# EAGLE design board (EAGLE 9.1.2)
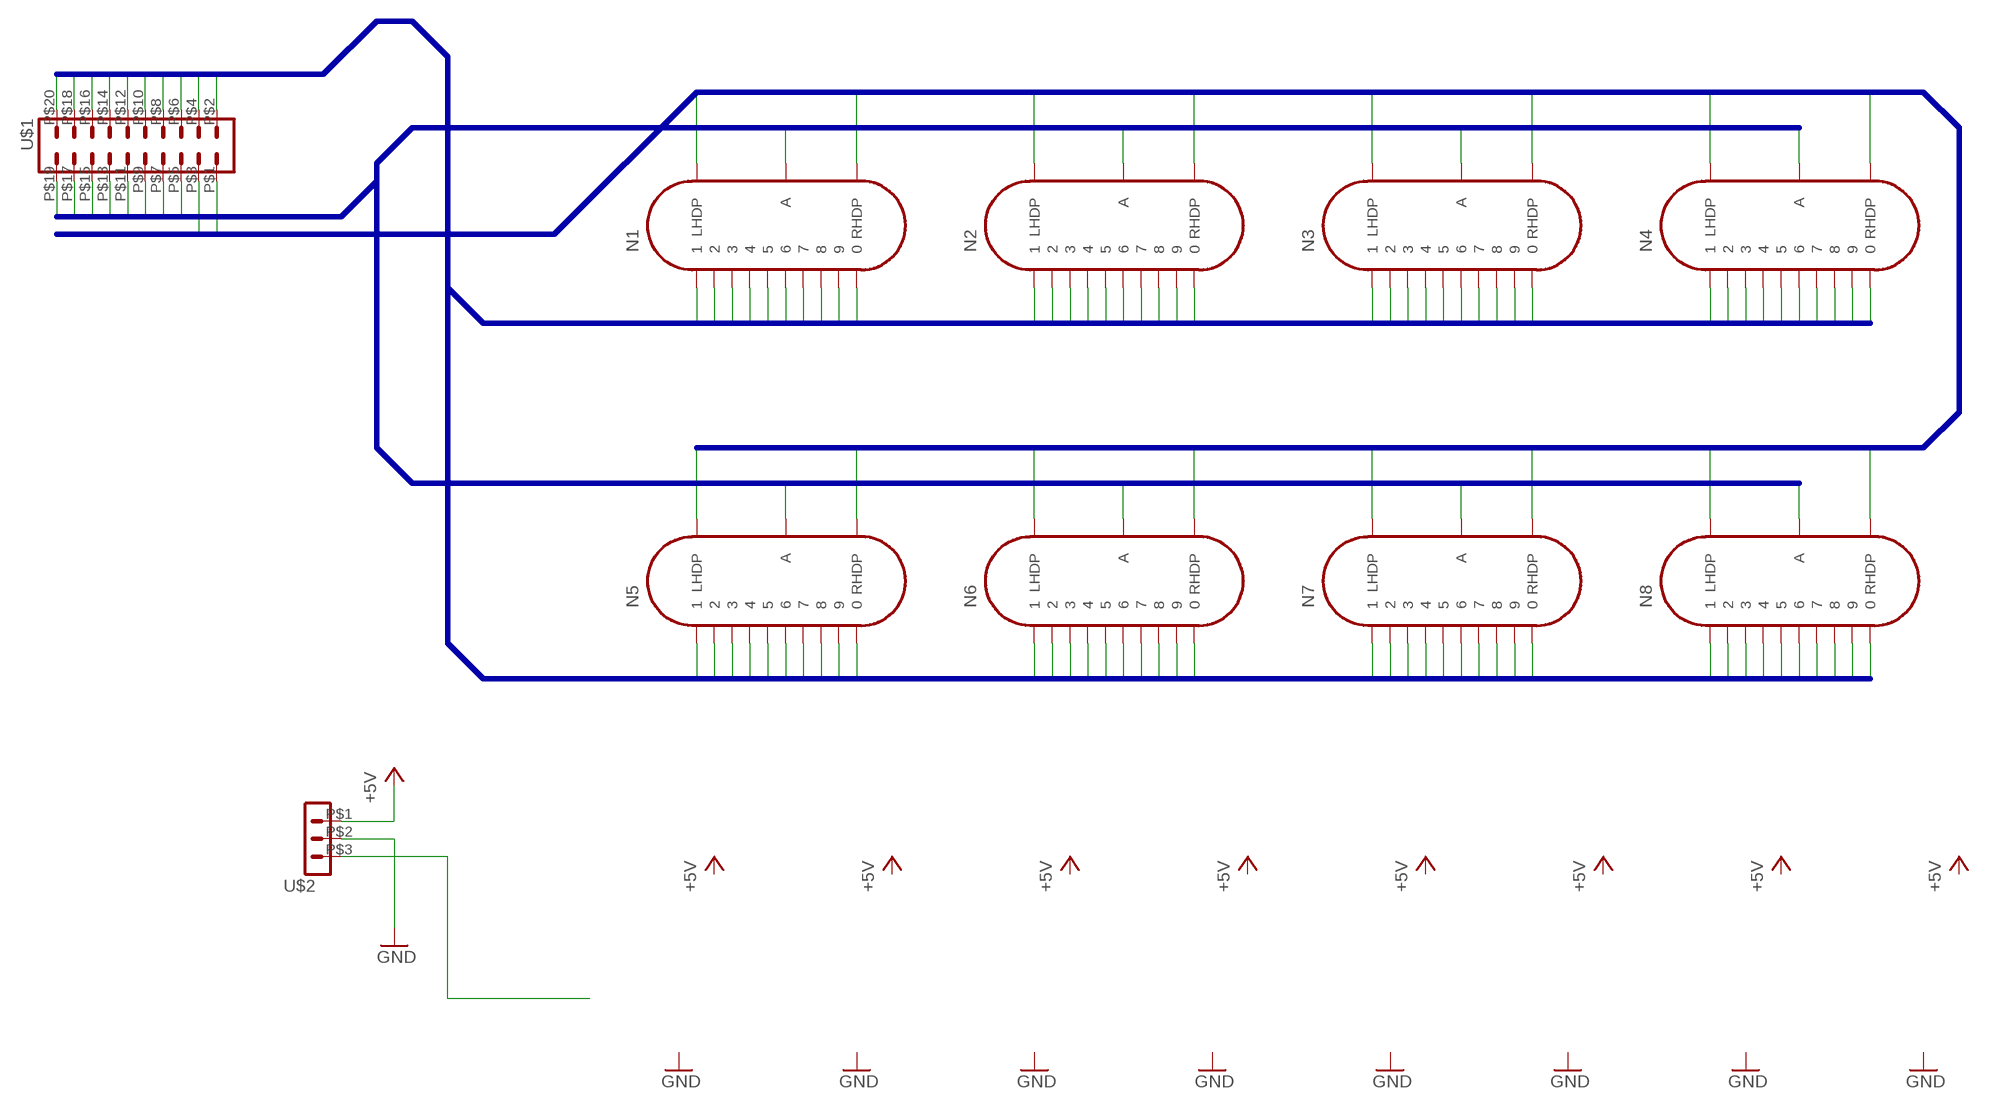
[diagram p0: schematic, sheet 1]

## Parts
N1  IN-14  [IN-14]
N2  IN-14  [IN-14]
N3  IN-14  [IN-14]
N4  IN-14  [IN-14]
N5  IN-14  [IN-14]
N6  IN-14  [IN-14]
N7  IN-14  [IN-14]
N8  IN-14  [IN-14]
U$1  PIN_HEADER_MALE_2X10_20P  [PIN_HEADER_MALE_2X10_20P]
U$2  PIN_HEADER_MALE_1X03_03P  [PIN_HEADER_MALE_1X03_03P]

## Nets
+5V: U$2.P$1
DOT0: N1.LHDP N2.LHDP N3.LHDP N4.LHDP N5.LHDP N6.LHDP N7.LHDP N8.LHDP U$1.P$3
DOT1: N1.RHDP N2.RHDP N3.RHDP N4.RHDP N5.RHDP N6.RHDP N7.RHDP N8.RHDP U$1.P$1
GND: U$2.P$2
N$8: U$2.P$3
NIXIE0: N1.0 N2.0 N3.0 N4.0 N5.0 N6.0 N7.0 N8.0 U$1.P$20
NIXIE1: N1.1 N2.1 N3.1 N4.1 N5.1 N6.1 N7.1 N8.1 U$1.P$18
NIXIE2: N1.2 N2.2 N3.2 N4.2 N5.2 N6.2 N7.2 N8.2 U$1.P$16
NIXIE3: N1.3 N2.3 N3.3 N4.3 N5.3 N6.3 N7.3 N8.3 U$1.P$14
NIXIE4: N1.4 N2.4 N3.4 N4.4 N5.4 N6.4 N7.4 N8.4 U$1.P$12
NIXIE5: N1.5 N2.5 N3.5 N4.5 N5.5 N6.5 N7.5 N8.5 U$1.P$10
NIXIE6: N1.6 N2.6 N3.6 N4.6 N5.6 N6.6 N7.6 N8.6 U$1.P$8
NIXIE7: N1.7 N2.7 N3.7 N4.7 N5.7 N6.7 N7.7 N8.7 U$1.P$6
NIXIE8: N1.8 N2.8 N3.8 N4.8 N5.8 N6.8 N7.8 N8.8 U$1.P$4
NIXIE9: N1.9 N2.9 N3.9 N4.9 N5.9 N6.9 N7.9 N8.9 U$1.P$2
NIXIE_ANODE1: N1.A U$1.P$5
NIXIE_ANODE2: N2.A U$1.P$7
NIXIE_ANODE3: N3.A U$1.P$9
NIXIE_ANODE4: N4.A U$1.P$11
NIXIE_ANODE5: N5.A U$1.P$13
NIXIE_ANODE6: N6.A U$1.P$15
NIXIE_ANODE7: N7.A U$1.P$17
NIXIE_ANODE8: N8.A U$1.P$19

## Buses
NIXIE_ANODE[1..16]
NIXIE[0..9]
DOT[0..1]

## Library data of the parts
N1-N8 = russian-nixies:IN-14: IN-14: medium numeric frontview nixie tube
U$1 = 160713 Library by matsu:PIN_HEADER_MALE_2X10_20P
U$2 = 160713 Library by matsu:PIN_HEADER_MALE_1X03_03P

## Net classes
0 default: width 0.635 mm, clearance 0.381 mm

## Board
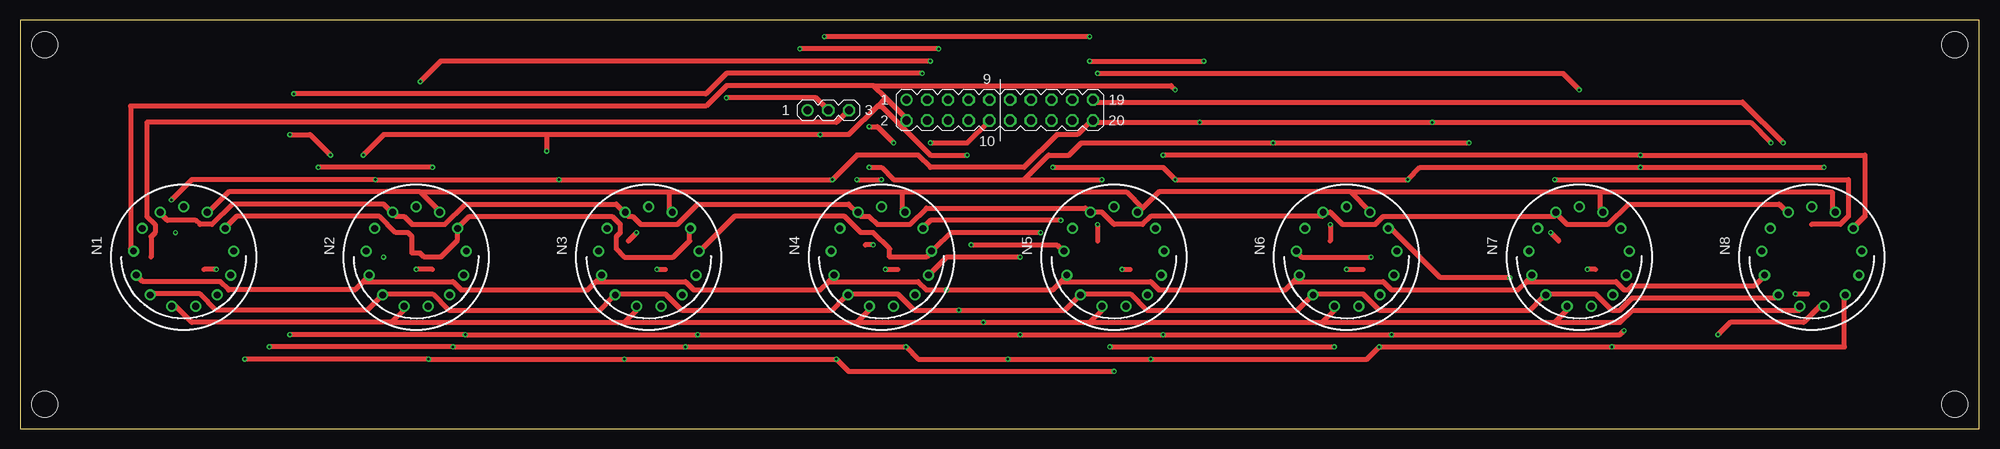
[diagram p1: board, top side]
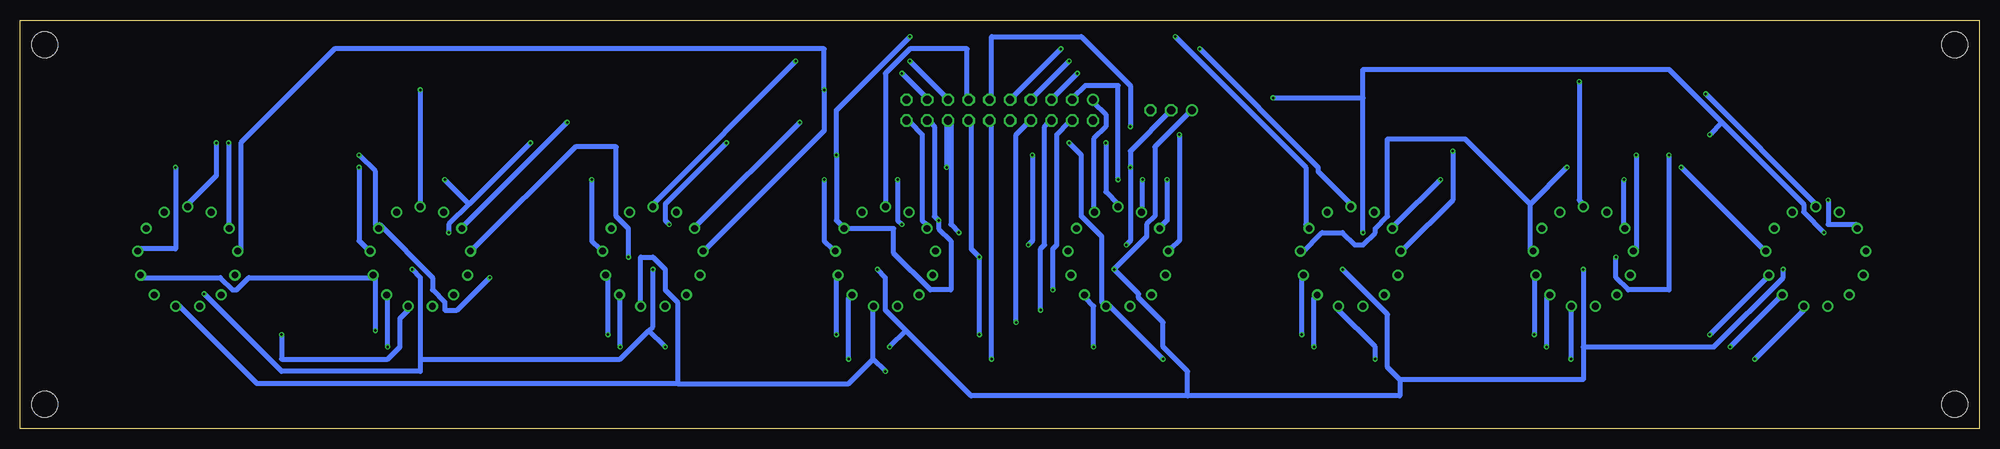
[diagram p2: board, bottom side, seen from below]

Size 240 x 50 mm. Coordinates in mm from the lower left corner, seen from the top.
Outline: 0,0 240,0 240,50 0,50 0,0
Copper layers (1*16): Top 0.035mm / dielectric 1.5mm / Bottom 0.035mm
Design rules "Elecrow_2-layer_eagle_rule": minimum track width 6mil, minimum drill 12mil, track to track 6mil, track to pad 6mil, pad to pad 6mil, via to via 6mil, smd to smd 0mil, copper to edge 10mil, drill to drill 10mil, minimum pad ring 10mil, minimum via ring 6mil, stop-mask expansion 2mil, vias tented up to drill 100mil, thermal gap 10mil
Holes 3.2 mm at 3,47 3,3 237,47 237,3

### Footprints (pad centres in the part's own frame; a part is rotated, then mirrored left to right if it is on the bottom)
IN-14 = drill 0.84: 0 5.094,-3.516; 1 -5.094,-3.516; 2 -6.145,-0.746; 3 -5.788,2.195; 4 -4.105,4.633; 5 -1.481,6.01; 6 1.481,6.01; 7 4.105,4.633; 8 5.788,2.195; 9 6.145,-0.746; A 0,-6.19; LHDP 2.877,-5.481; RHDP -2.877,-5.481
PIN_HEADER_MALE_2X10_20P = drill 1: P$1 -11.43,1.27 | drill 1 octagon: P$2 -11.43,-1.27; P$3 -8.89,1.27; P$4 -8.89,-1.27; P$5 -6.35,1.27; P$6 -6.35,-1.27; P$7 -3.81,1.27; P$8 -3.81,-1.27; P$9 -1.27,1.27; P$10 -1.27,-1.27; P$11 1.27,1.27; P$12 1.27,-1.27; P$13 3.81,1.27; P$14 3.81,-1.27; P$15 6.35,1.27; P$16 6.35,-1.27; P$17 8.89,1.27; P$18 8.89,-1.27; P$19 11.43,1.27; P$20 11.43,-1.27
PIN_HEADER_MALE_1X03_03P = drill 1: P$1 -2.54,0 | drill 1 octagon: P$2 0,0; P$3 2.54,0

### Placement (x,y rotation side)
N1  20,21 180 top
N2  48.5,21 180 top
N3  77,21 180 top
N4  105.5,21 180 top
N5  134,21 180 top
N6  162.5,21 180 top
N7  191,21 180 top
N8  219.5,21 180 top
U$1  120,39 0 top
U$2  99,39 0 top

### Tracks (layer width: path | path; a pad name or v marks a point on that pad's centre or on a via)
+5V  (via drill 0.3)
  Top 0.635: v162.5,19.5 164.5,19.5 | 193,19.5 v192,19.5 | v217.5,16.5 219,16.5 | v106,19.5 107.5,19.5 | v24,19.5 22.5,19.5 | 50.5,19.5 v48.5,19.5 | v78,19.5 79,19.5 | v135,19.5 136,19.5 | v133.5,10 v161,10
  Bottom 0.635: v162.5,19.5 162.5,12.5 163,12 | 163,12 166.5,8.5 191,8.5 | 191,8.5 191,18.5 v192,19.5 | v217.5,16.5 208,7 191,7 191,8.5 | U$2.P$1 96.5,39 101,34.5 101,26 102,25 102,23.5 v106,19.5 103,16.5 103,16 100,13 100,10 97,7 97,4 | v24,19.5 24,18.5 32.5,10 48.5,10 | v48.5,19.5 48.5,10 | v78,19.5 72.5,14 72.5,7.5 71,6 | 71,6 48.5,6 48.5,10 | v135,19.5 134,18.5 134,14.5 131.5,12 | 131.5,12 123.5,4 97,4 | 97,4 71,4 71,6 | v161,10 163,12 | 131.5,12 v133.5,10
DOT0  (via drill 0.3)
  Top 0.635: N8.LHDP 216.5,26.5 215.5,27.5 197,27.5 194.5,25 189.5,25 188.5,26 N7.LHDP 188,26 167,26 166,25 162,25 160.5,26.5 160,26.5 N6.LHDP 159.5,26 138.5,26 137.5,25 134,25 132.5,26.5 131.5,26.5 N5.LHDP 131,26.5 130.5,27 111,27 109,25 105,25 104,26 103,26 N4.LHDP 102.5,26.5 101.5,27.5 83,27.5 80.5,25 76,25 75,26 74.5,26 N3.LHDP 74,26.5 73,27.5 54.5,27.5 52,25 48,25 47,26 46,26 N2.LHDP 45.5,26.5 44.5,27.5 26,27.5 23.5,25 22,25 21.5,25.5 18,25.5 17.5,26 N1.LHDP | v102.5,30.5 v105.5,30.5
  Bottom 0.635: v105.5,30.5 105.5,42 109.5,42 111,40.5 U$1.P$3 | v102.5,30.5 102.5,26.5 N4.LHDP
DOT1
  Top 0.635: 137.5,27 139.5,29 163,29 | 137.5,27 137,26.5 N5.RHDP | 163,29 165.5,26.5 N6.RHDP | 193.5,29 193.5,26.5 N7.RHDP | 163,29 193.5,29 | 193.5,29 222,29 222,26.5 N8.RHDP | 49,29 25.5,29 23,26.5 N1.RHDP | 49,29 51.5,26.5 N2.RHDP | 79.5,29 79.5,26.5 N3.RHDP | 49,29 79.5,29 | 108,29 108,26.5 N4.RHDP | 79.5,29 108,29 | 137.5,27 135.5,29 108,29
  Bottom 0.635: N4.RHDP 108.5,26.5 108.5,35.5 107,37 107,38.5 108.5,40 U$1.P$1
GND  (via drill 0.3)
  Top 0.635: 74.5,23 v75.5,24 | v38,33.5 35.5,36 v33,36 | v104.5,22.5 103.5,22.5 | v132,25 132,23 | 123,30.5 107,30.5 105.5,32 v104,32 | 123,30.5 v132.5,30.5 | v160.5,25 160.5,23 | 123,30.5 126,33.5 128.5,33.5 130,35 v153.5,35 v177.5,35 | v187.5,24 188.5,23 | 219.5,25 223,25 224,26 224,30.5 v188,30.5 | v86.5,40.5 97.5,40.5 U$2.P$2
  Bottom 0.635: v19,24 21.5,26.5 21.5,27.5 31.5,37.5 | 31.5,37.5 38,44 75.5,44 75.5,40.5 | v75.5,24 75.5,40.5 | v44.5,21 44.5,18.5 43,17 38,17 v38,33.5 | 31.5,37.5 v33,36 | v104.5,22.5 104,23 v104,32 104,34 U$2.P$2 | v132,25 132.5,25.5 v132.5,30.5 | v160.5,25 161,25.5 161,27.5 v153.5,35 | v187.5,24 187.5,25 185,27.5 | v177.5,35 185,27.5 | 185,27.5 v188,30.5 | v86.5,40.5 75.5,40.5
N$8
  Top 0.635: 16,21 16,23.5 16.5,24 16.5,25 15.5,26 15.5,37.5 100,37.5 101.5,39 U$2.P$3
NIXIE0  (via drill 0.3)
  Top 0.635: v18.5,28 21,30.5 v43.5,30.5 v66,30.5 v99.5,30.5 102.5,33.5 110,33.5 111.5,32 123,32 127,36 129.5,36 131,37.5 U$1.P$20 131.5,37.5 v144.5,37.5 v173,37.5 212,37.5 v214.5,35
  Bottom 0.635: v18.5,28 18.5,25 15,25 N1.0 | v43.5,30.5 43.5,25 N2.0 | v66,30.5 71.5,25 N3.0 | v99.5,30.5 99.5,25.5 100,25 N4.0 | N5.0 129,25 129.5,25.5 129.5,36 131,37.5 U$1.P$20 | v144.5,37.5 157,25 N6.0 | v173,37.5 185.5,25 N7.0 | v214.5,35 214.5,25 N8.0
NIXIE1  (via drill 0.3)
  Top 0.635: N1.1 25.5,25 26.5,26 44,26 46,24 47.5,24 48,23.5 48,21.5 49,21.5 49.5,21 51.5,21 53.5,23 53.5,24.5 N2.1 54,25 55,26 72.5,26 73.5,25 73.5,24 73,23.5 73,22 74,21 80,21 82,23 82,24.5 N3.1 | v127.5,25.5 111.5,25.5 111,25 N4.1 | v182.5,18.5 174,18.5 168,24.5 N6.1 | N8.1 225,25 226,26 226,33.5 v198.5,33.5 v140,33.5 | v131,48 v98.5,48
  Bottom 0.635: U$1.P$18 128.5,37.5 128,37 128,26 v127.5,25.5 127.5,24.5 126,23 126,17 128.5,17 133,21.5 133,24.5 139,24.5 N5.1 139.5,25 140,25.5 v140,33.5 140,39 v131,48 | v182.5,18.5 186.5,14.5 188,14.5 188,15.5 189.5,17 189.5,18.5 196,25 N7.1 196.5,25 196.5,31.5 v198.5,33.5 | v98.5,48 82.5,32 82.5,25 N3.1
NIXIE2  (via drill 0.3)
  Top 0.635: v50.5,32 v36.5,32 | N3.2 83.5,22 87.5,26 101,26 103,24 104.5,24 106.5,22 106.5,21 111,21 111.5,21.5 N4.2 112,22 114,24 v125,24 | v126.5,32 140,32 v141.5,30.5 v170,30.5 171.5,32 v198.5,32 v221,32
  Bottom 0.635: v36.5,32 26.5,22 N1.2 | 55,27.5 v50.5,32 | 55,27.5 55,22 N2.2 | v141.5,30.5 141.5,23 140.5,22 N5.2 | v126.5,32 126.5,37.5 U$1.P$16 126,37.5 126,25 v125,24 | v170,30.5 170,23 169,22 N6.2 | v198.5,32 198.5,23 197.5,22 N7.2 | v221,32 221,22 225.5,22 N8.2 | 55,27.5 63,35.5 72.5,35.5 72.5,26 74,24.5 74,24 75.5,22.5 76.5,22.5 78,24 80.5,24 83,21.5 N3.2
NIXIE3  (via drill 0.3)
  Top 0.635: v122.5,21 113.5,21 111.5,19 N4.3 | v33,11.5 v54.5,11.5 v83,11.5 v122.5,11.5 v140,11.5 v168,11.5 196,11.5 v196.5,12
  Bottom 0.635: U$1.P$14 123.5,37.5 123.5,22 v122.5,21 v122.5,11.5 | N8.3 225,18.5 215.5,18.5 214,17 213.5,17 212,18.5 197,18.5 N7.3 196.5,18.5 v196.5,12 | v33,11.5 26,18.5 N1.3 | v54.5,11.5 54.5,18.5 N2.3 | v83,11.5 83,18.5 N3.3 | v140,11.5 140,18.5 N5.3 | v168,11.5 168,18.5 N6.3
NIXIE4  (via drill 0.3)
  Top 0.635: v30.5,10 v53,10 v81.5,10 v108.5,10 110,8.5 v121,8.5 v138.5,8.5 165,8.5 v166.5,10 v195,10 223.5,10 223.5,16 N8.4
  Bottom 0.635: v30.5,10 24.5,16 N1.4 | v53,10 53,16 N2.4 | v81.5,10 81.5,16 N3.4 | v108.5,10 108.5,15 109.5,16 N4.4 | v138.5,8.5 138.5,16 N5.4 | v166.5,10 166.5,16 N6.4 | v195,10 195,16 N7.4 | v121,8.5 121,37.5 U$1.P$12
NIXIE5  (via drill 0.3)
  Top 0.635: v208,11.5 209.5,13 218.5,13 220.5,15 N8.5 | v27.5,8.5 v50,8.5 v74,8.5 v100,8.5 101.5,7 v134,7 | U$1.P$10 116,35 v111.5,35
  Bottom 0.635: v208,11.5 208,8.5 195,8.5 193.5,10 193.5,13.5 192.5,14.5 N7.5 | 135.5,8.5 135.5,14.5 N5.5 | 135.5,8.5 138.5,5.5 159.5,5.5 | 159.5,5.5 159.5,15.5 161,17 161,19.5 162.5,21 164,21 164,15 N6.5 | 159.5,5.5 211,5.5 220.5,15 N8.5 | v27.5,8.5 21.5,14.5 N1.5 | v50,8.5 50,14.5 N2.5 | v74,8.5 74,10 78.5,14.5 N3.5 | v100,8.5 106.5,15 N4.5 107,15 107.5,15.5 107.5,23.5 110,26 110,33.5 v111.5,35 | v134,7 135.5,8.5
NIXIE6  (via drill 0.3)
  Top 0.635: 45.5,13 21,13 19,15 N1.6 | 45.5,13 47,14.5 N2.6 | 74,13 75.5,14.5 N3.6 | 45.5,13 74,13 | 102.5,13 104,14.5 N4.6 | 74,13 102.5,13 | 131,13 132.5,14.5 N5.6 | 102.5,13 v118,13 131,13 | 159.5,13 161,14.5 N6.6 | 131,13 159.5,13 | 188,13 189.5,14.5 N7.6 | 159.5,13 188,13 | 188,13 196,13 197.5,14.5 218,14.5 N8.6
  Bottom 0.635: v118,13 118,36 116.5,37.5 U$1.P$8
NIXIE7  (via drill 0.3)
  Top 0.635: N1.7 16,16.5 22,16.5 24,14.5 42.5,14.5 44,16 N2.7 44.5,16.5 50.5,16.5 52.5,14.5 71,14.5 72.5,16 N3.7 73,16.5 79,16.5 81,14.5 99.5,14.5 101,16 N4.7 101.5,16.5 107.5,16.5 109.5,14.5 v115,14.5 128,14.5 129.5,16 N5.7 130,16.5 136,16.5 138,14.5 156.5,14.5 158,16 N6.7 158.5,16.5 164.5,16.5 166.5,14.5 185,14.5 186.5,16 N7.7 187,16.5 193,16.5 195,14.5 196,14.5 197.5,16 215,16 N8.7
  Bottom 0.635: v115,14.5 115,22 114.5,22.5 114.5,37 114,37.5 U$1.P$6
NIXIE8  (via drill 0.3)
  Top 0.635: 42,18 42.5,18.5 N2.8 | 42,18 41,17 25.5,17 24.5,18 15,18 14.5,18.5 N1.8 | 70.5,18 69.5,17 54,17 53,18 42,18 | 70.5,18 71,18.5 N3.8 | 99,18 98,17 82.5,17 81.5,18 70.5,18 | 99,18 99.5,18.5 N4.8 | 127.5,18 126.5,17 v113.5,17 111,17 110,18 99,18 | 127.5,18 128,18.5 N5.8 | 156,18 155,17 139.5,17 138.5,18 127.5,18 | 156,18 156.5,18.5 N6.8 | 184.5,18 183.5,17 168,17 167,18 156,18 | 184.5,18 185,18.5 N7.8 | 184.5,18 195.5,18 196.5,17 197,17 197.5,17.5 212.5,17.5 213.5,18.5 N8.8
  Bottom 0.635: v113.5,17 113.5,22 113,22.5 113,36 111.5,37.5 U$1.P$4
NIXIE9  (via drill 0.3)
  Top 0.635: 104.5,42 86.5,42 84,39.5 13.5,39.5 13.5,22 N1.9 | 106,40.5 108.5,38 U$1.P$2 | 106,40.5 104.5,42 | v42,33.5 44.5,36 64.5,36 | 64.5,36 v98,36 101.5,36 105,39.5 | 106,40.5 105,39.5 | 64.5,36 v64.5,34 | v116.5,22.5 127,22.5 127.5,22 N5.9 | v116,33.5 111.5,33.5 105.5,39.5 105,39.5 | v141.5,41.5 141,42 104.5,42 | v165.5,21 157,21 156.5,21.5 N6.9
  Bottom 0.635: v42,33.5 42,22 N2.9 | v64.5,34 64.5,28 70.5,22 N3.9 | v98,36 98,23 99,22 N4.9 | v116.5,22.5 116,23 v116,33.5 | N6.9 156,22 141.5,36.5 v141.5,41.5 141.5,46.5 201.5,46.5 213,35 213,22 N8.9 | v165.5,21 165.5,24.5 167,26 167,34.5 172,34.5 184.5,22 N7.9
NIXIE_ANODE1  (via drill 0.3)
  Top 0.635: v33.5,41 84,41 86.5,43.5 v110.5,43.5
  Bottom 0.635: v33.5,41 20,27.5 N1.A | v110.5,43.5 113.5,40.5 U$1.P$5
NIXIE_ANODE2  (via drill 0.3)
  Top 0.635: v49,42.5 51.5,45 v111.5,45
  Bottom 0.635: v49,42.5 49,28 48.5,27.5 N2.A | v111.5,45 116,40.5 U$1.P$7
NIXIE_ANODE3  (via drill 0.3)
  Top 0.635: v112.5,46.5 v95.5,46.5
  Bottom 0.635: v95.5,46.5 81,32 81,31.5 77,27.5 N3.A | U$1.P$9 v112.5,46.5
NIXIE_ANODE4  (via drill 0.3)
  Top 0.635: v107,35 105,37 v104,37
  Bottom 0.635: v107,35 107,29 105.5,27.5 N4.A | v104,37 104,42 110,48 121,48 121,40.5 U$1.P$11
NIXIE_ANODE5
  Bottom 0.635: N5.A 134,43.5 131,46.5 124,46.5 124,40.5 U$1.P$13
NIXIE_ANODE6  (via drill 0.3)
  Top 0.635: v131,45 v145,45
  Bottom 0.635: v145,45 162.5,27.5 N6.A | v131,45 126.5,40.5 U$1.P$15
NIXIE_ANODE7  (via drill 0.3)
  Top 0.635: v191,41.5 189,43.5 v132,43.5
  Bottom 0.635: v191,41.5 N7.A | v132,43.5 129,40.5 U$1.P$17
NIXIE_ANODE8  (via drill 0.3)
  Top 0.635: v216,35 211,40 131.5,40 U$1.P$19
  Bottom 0.635: v216,35 216,31 219.5,27.5 N8.A